# Altium schematic sheet AZ943_gp_relay.SchDoc
size A; SheetNumber: 1; SheetTotal: 1
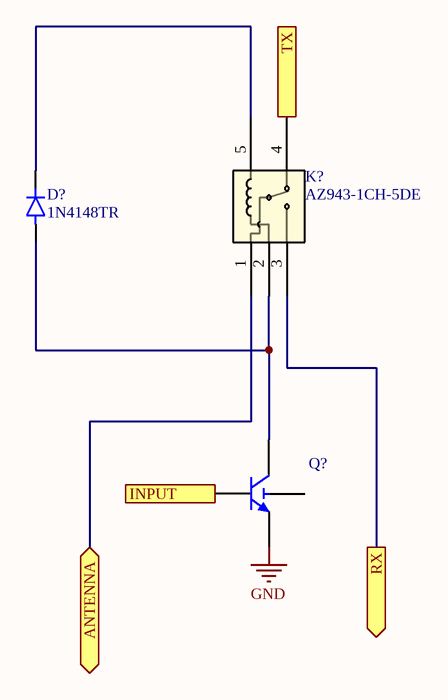
[diagram p0: AZ943_gp_relay.SchDoc]

## Parts
D?  1N4148TR  [DIOAD753W49L380D172B]
K?  AZ943-1CH-5DE  [K_AZ943-1C_AMZ]
Q?  Bipolar NPN 4 Pins  Transistor Gummel-Poon Model  (value not drawn)

## Ports
ANTENNA (bidir), INPUT (in), RX (out), TX (out)

## Nets
GND: Q?.3(E)
ANTENNA: K?.1 ; port ANTENNA
INPUT: Q?.2(B) ; port INPUT
RX: K?.3 ; port RX
TX: K?.4 ; port TX
NetD?_A: D?.A K?.2 Q?.1(C)
NetD?_K: D?.K K?.5

Not connected (* = marked no-connect by the designer): Q? 4(S)

## Library data of the parts
D? = 1N4148TR: MF: {'manufacturer': u'onsemi'}; Package: None; Price: None; Value: *; MP: 1N4148TR; Availability: Unavailable
K? = AZ943-1CH-5DE: No Description Available; Mfr_Name: American Zettler; Type: Power Relays; RefDes: RefDes
Q? = BJT NPN 4 GP: SimulationGenericComponent: True; BF: 100; AF: 0; BR: 1; EG: 1.11; FC: 0.5; IS: 1e-16; MJC: 0.33; NC: 2; NE: 1.5; TNOM: 27; VBC_MAX: 1e99; VJC: 0.75; XTI: 3; CJC: 0; CJE: 0; CJS: 0; CTC: 0; CTE: 0; CTS: 0; IKF: 0; IKR: 0; IRB: 0; ISC: 0; ISE: 0; ISS: 0; ITF: 0; KF: 0; MJE: 0.33; MJS: 0; NF: 1; NKF: 0.5; NR: 1; NS: 1; PTF: 0; RB: 0; RBM: 0; RC: 0; RE: 0; SUBS: 1; TBF1: 0; TBF2: 0; TBR1: 0; TBR2: 0; TF: 0; TIKF1: 0; TIKF2: 0; TIKR1: 0; TIKR2: 0; TIRB1: 0; TIRB2: 0; TIS1: 0; TIS2: 0; TISC1: 0; TISC2: 0; TISE1: 0; TISE2: 0; TITF1: 0; TITF2: 0; TLEV: 0; TLEVC: 0; TMJC1: 0; TMJC2: 0; TMJE1: 0; TMJE2: 0; TMJS1: 0; TMJS2: 0; TNC1: 0; TNC2: 0; TNE1: 0; TNE2: 0; TNF1: 0; TNF2: 0; TNR1: 0; TNR2: 0; TNS1: 0; TNS2: 0; TR: 0; TRB1: 0; TRB2: 0; TRC1: 0; TRC2: 0; TRE1: 0; TRE2: 0; TRM1: 0; TRM2: 0; TTF1: 0; TTF2: 0; TTR1: 0; TTR2: 0; TVAF1: 0; TVAF2: 0; TVAR1: 0; TVAR2: 0; TVJC: 0; TVJE: 0; TVJS: 0; VAF: 0; VAR: 0; VBE_MAX: 1e99; VCE_MAX: 1e99; VJE: 0.75; VJS: 0.75; VTF: 0; XCJC: 1; XTB: 0; XTF: 0